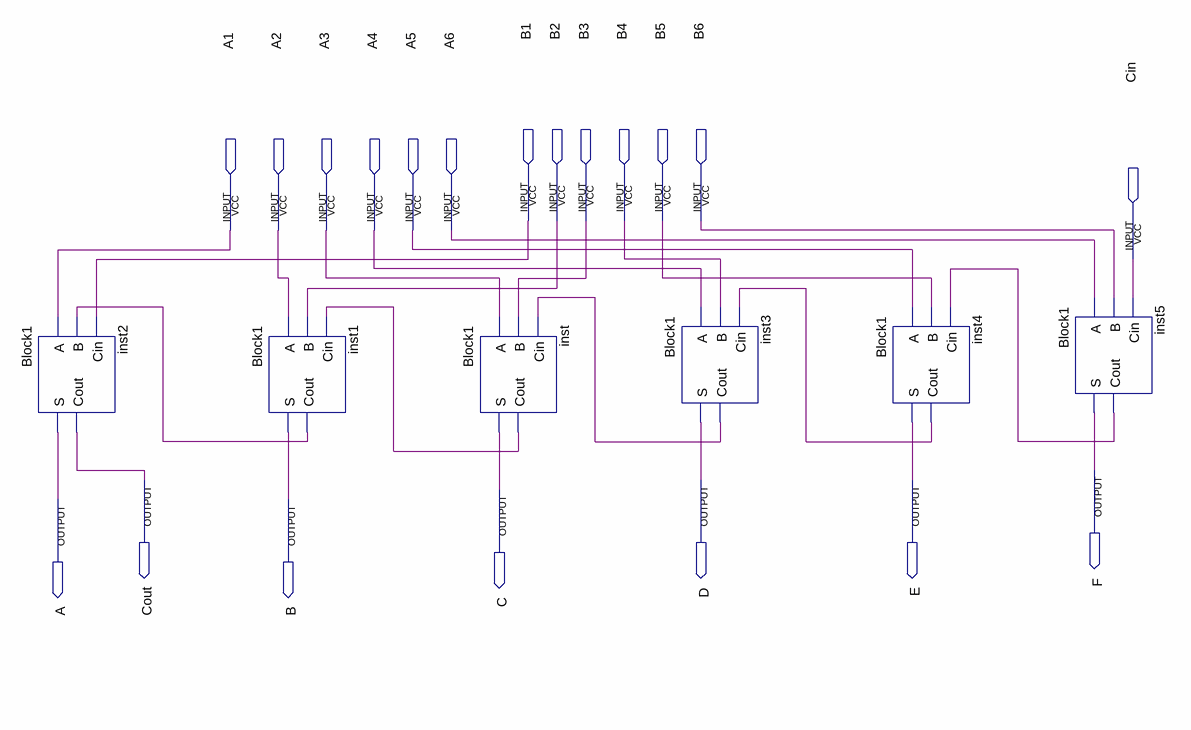
[diagram p0: schematic sheet]
// Quartus schematic SOMADOR_6BITS.bdf as structural Verilog: 6 symbols, 20 pins
module SOMADOR_6BITS (
  input  B1,
  input  B2,
  input  B3,
  input  B4,
  input  B5,
  input  B6,
  input  A1,
  input  A2,
  input  A3,
  input  A4,
  input  A5,
  input  A6,
  input  Cin,
  output F,
  output Cout,
  output D,
  output E,
  output C,
  output A,
  output B
);

  wire inst1_cout, inst3_cout, inst4_cout, inst5_cout, inst_cout;

  Block1 inst2 (.A(A1), .B(inst1_cout), .Cin(B1), .S(A), .Cout(Cout));
  Block1 inst1 (.A(A2), .B(B2), .Cin(inst_cout), .S(B), .Cout(inst1_cout));
  Block1 inst (.A(A3), .B(B3), .Cin(inst3_cout), .S(C), .Cout(inst_cout));
  Block1 inst3 (.A(A4), .B(B4), .Cin(inst4_cout), .S(D), .Cout(inst3_cout));
  Block1 inst4 (.A(A5), .B(B5), .Cin(inst5_cout), .S(E), .Cout(inst4_cout));
  Block1 inst5 (.A(A6), .B(B6), .Cin(Cin), .S(F), .Cout(inst5_cout));
endmodule
